# Altium project shieldMegaEstacionTT.PrjPcb
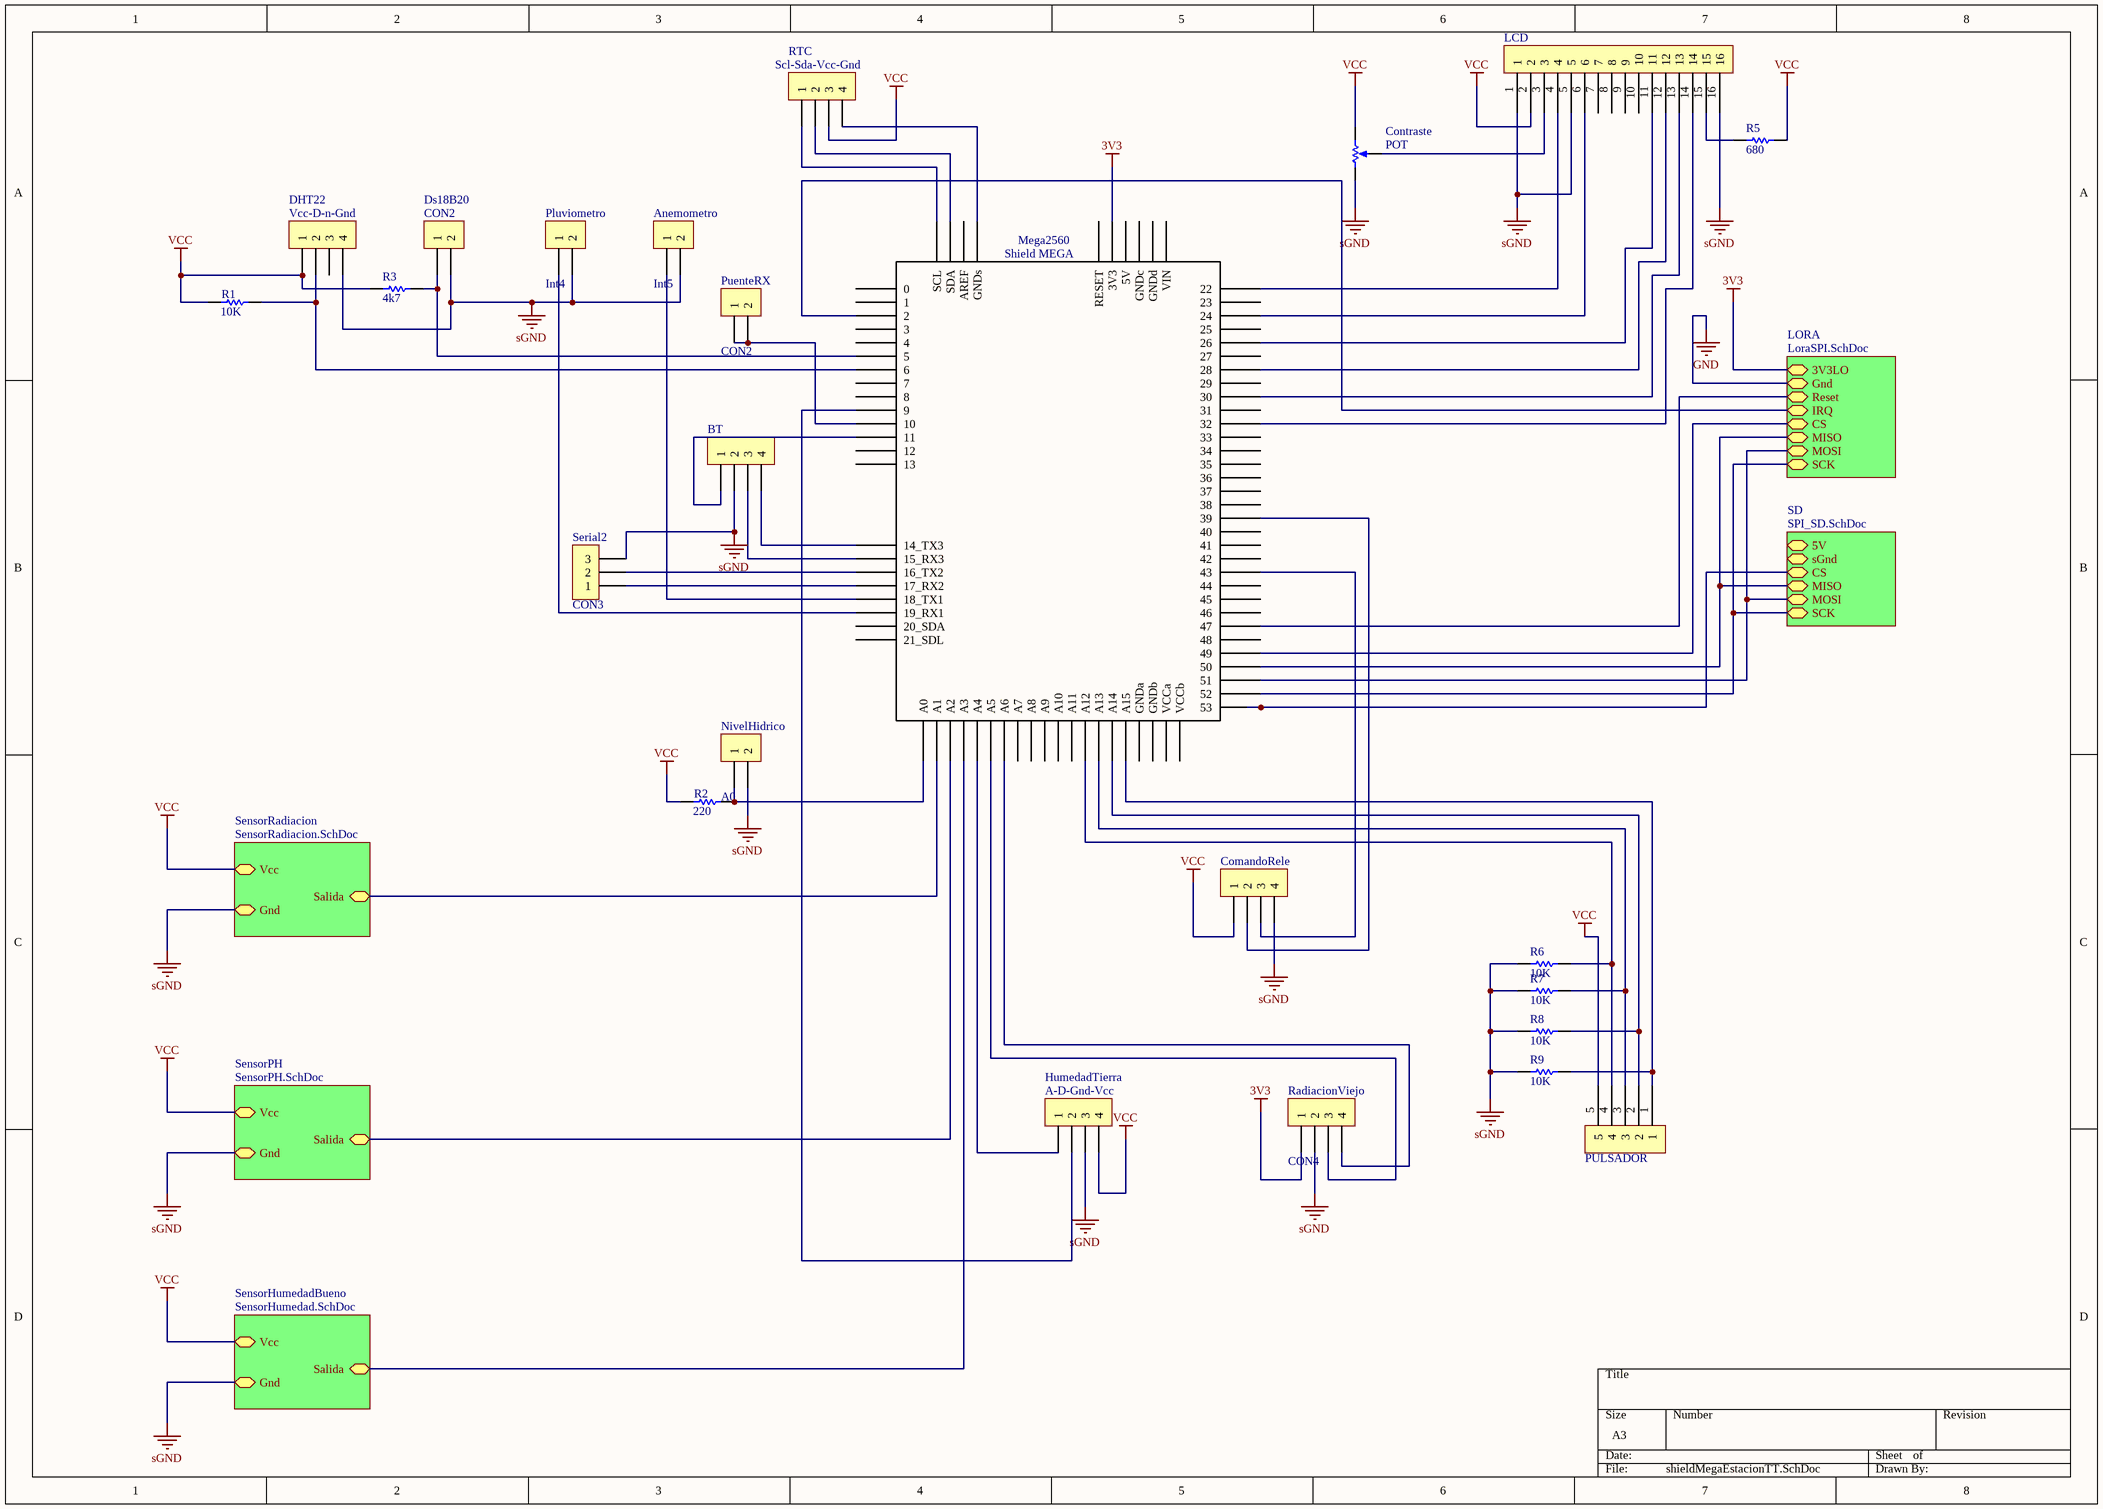
[diagram p0: shieldMegaEstacionTT.SchDoc]
6 sheets, 68 parts. Net scope: hierarchical (ports join the sheet entries above them; power ports are global).
Board file: shieldMegaEstacionTT.PcbDoc
Sheets:
  shieldMegaEstacionTT.SchDoc
    SensorRadiacion = SensorRadiacion.SchDoc
    SensorPH = SensorPH.SchDoc
    SensorHumedadBueno = SensorHumedad.SchDoc
    LORA = LoraSPI.SchDoc
    SD = SPI_SD.SchDoc

## Sheet shieldMegaEstacionTT.SchDoc
size A3

### Parts
Anemometro  Int5  [BORNERA2 - T]
BT  CON4  [CON4]  (value not drawn)
ComandoRele  CON4  [CON4]  (value not drawn)
Contraste  POT  [PRESET2]
DHT22  Vcc-D-n-Gnd  [BORNERA4]
Ds18B20  CON2  [BORNERA2 - T]
HumedadTierra  A-D-Gnd-Vcc  [CON4]
LCD  CON16  [CON2X8]  (value not drawn)
Mega2560  Shield MEGA  [Shield Mega]
NivelHidrico  A0  [BORNERA2 - T]
Pluviometro  Int4  [BORNERA2 - T]
PuenteRX  CON2  [CON2]
PULSADOR  CON5  [CON5]  (value not drawn)
R1  10K  [RES300]
R2  220  [RES300]
R3  4k7  [RES300]
R5  680  [RES300]
R6  10K  [RES300]
R7  10K  [RES300]
R8  10K  [RES300]
R9  10K  [RES300]
RadiacionViejo  CON4  [BORNERA4 - T]
RTC  Scl-Sda-Vcc-Gnd  [CON4]
Serial2  CON3  [CON3]

### Sub-sheets
LORA = LoraSPI.SchDoc: 3V3LO (bidir), Gnd, Reset, IRQ, CS, MISO, MOSI, SCK
SD = SPI_SD.SchDoc: 5V, sGnd, CS, MISO, MOSI, SCK
SensorHumedadBueno = SensorHumedad.SchDoc: Vcc, Gnd, Salida
SensorPH = SensorPH.SchDoc: Vcc, Gnd, Salida
SensorRadiacion = SensorRadiacion.SchDoc: Vcc, Gnd, Salida

### Nets
3V3: Mega2560.3V3 RadiacionViejo.1 ; sheet LORA/3V3LO
sGND: Anemometro.2 BT.2 ComandoRele.4 Contraste.2 DHT22.4 Ds18B20.2 HumedadTierra.3 LCD.1 LCD.5 LCD.16 NivelHidrico.2 Pluviometro.2 R6.1 R7.1 R8.1 R9.1 RadiacionViejo.2 Serial2.3 ; sheet SensorRadiacion/Gnd, sheet SensorPH/Gnd, sheet SensorHumedadBueno/Gnd
VCC: ComandoRele.1 Contraste.1 DHT22.1 HumedadTierra.4 LCD.2 PULSADOR.5 R1.1 R2.1 R3.1 R5.1 RTC.3 ; sheet SensorRadiacion/Vcc, sheet SensorPH/Vcc, sheet SensorHumedadBueno/Vcc
NetAnemometro_1: Anemometro.1 Mega2560.18(18_TX1)
NetBT_1: BT.1 Mega2560.11
NetBT_3: BT.3 Mega2560.15(15_RX3)
NetBT_4: BT.4 Mega2560.14(14_TX3)
NetComandoRele_2: ComandoRele.2 Mega2560.39
NetComandoRele_3: ComandoRele.3 Mega2560.43
NetContraste_3: Contraste.3 LCD.3
NetDHT22_2: DHT22.2 Mega2560.6 R1.2
NetDs18B20_1: Ds18B20.1 Mega2560.5 R3.2
NetHumedadTierra_1: HumedadTierra.1 Mega2560.A4
NetHumedadTierra_2: HumedadTierra.2 Mega2560.9
NetIC1Lora_8: Mega2560.50 ; sheet LORA/MISO, sheet SD/MISO
NetIC2SD_1: Mega2560.53 ; sheet SD/CS
NetIC2SD_2: Mega2560.52 ; sheet LORA/SCK, sheet SD/SCK
NetIC2SD_12: Mega2560.51 ; sheet LORA/MOSI, sheet SD/MOSI
NetLCD_4: LCD.4 Mega2560.22
NetLCD_6: LCD.6 Mega2560.24
NetLCD_11: LCD.11 Mega2560.26
NetLCD_12: LCD.12 Mega2560.28
NetLCD_13: LCD.13 Mega2560.30
NetLCD_14: LCD.14 Mega2560.32
NetLCD_15: LCD.15 R5.2
NetMega2560_2: Mega2560.2 ; sheet LORA/IRQ
NetMega2560_10: Mega2560.10 PuenteRX.1 PuenteRX.2
NetMega2560_16: Mega2560.16(16_TX2) Serial2.2
NetMega2560_17: Mega2560.17(17_RX2) Serial2.1
NetMega2560_19: Mega2560.19(19_RX1) Pluviometro.1
NetMega2560_47: Mega2560.47 ; sheet LORA/Reset
NetMega2560_49: Mega2560.49 ; sheet LORA/CS
NetMega2560_A0: Mega2560.A0 NivelHidrico.1 R2.2
NetMega2560_A1: Mega2560.A1 ; sheet SensorRadiacion/Salida
NetMega2560_A2: Mega2560.A2 ; sheet SensorPH/Salida
NetMega2560_A3: Mega2560.A3 ; sheet SensorHumedadBueno/Salida
NetMega2560_A5: Mega2560.A5 RadiacionViejo.3
NetMega2560_A6: Mega2560.A6 RadiacionViejo.4
NetMega2560_A12: Mega2560.A12 PULSADOR.4 R6.2
NetMega2560_A13: Mega2560.A13 PULSADOR.3 R7.2
NetMega2560_A14: Mega2560.A14 PULSADOR.2 R8.2
NetMega2560_A15: Mega2560.A15 PULSADOR.1 R9.2
NetMega2560_GNDs: Mega2560.GNDs RTC.4
NetMega2560_SCL: Mega2560.SCL RTC.1
NetMega2560_SDA: Mega2560.SDA RTC.2

Not connected (* = marked no-connect by the designer): DHT22 3; LCD 7 8 9 10; Mega2560 0 1 3 4 5V 7 8 12 13 20(20_SDA) 21(21_SDL) 23 25 27 29 31 33 34 35 36 37 38 40 41 42 44 45 46 48 A7 A8 A9 A10 A11 AREF GNDa GNDb GNDc GNDd RESET VCCa VCCb VIN

### Library data of the parts
Anemometro Ds18B20 NivelHidrico Pluviometro PuenteRX = CON2: Conector 2
BT ComandoRele DHT22 HumedadTierra RadiacionViejo RTC = CON4: Conector 4
Contraste = POT: Potenciometro - Preset
LCD = CON16: Conector 16
PULSADOR = CON5: Conector 5
R1-R3 R5-R9 = RES: Resistencia
Serial2 = CON3: Conector 3

## Sheet SensorRadiacion.SchDoc
size A4
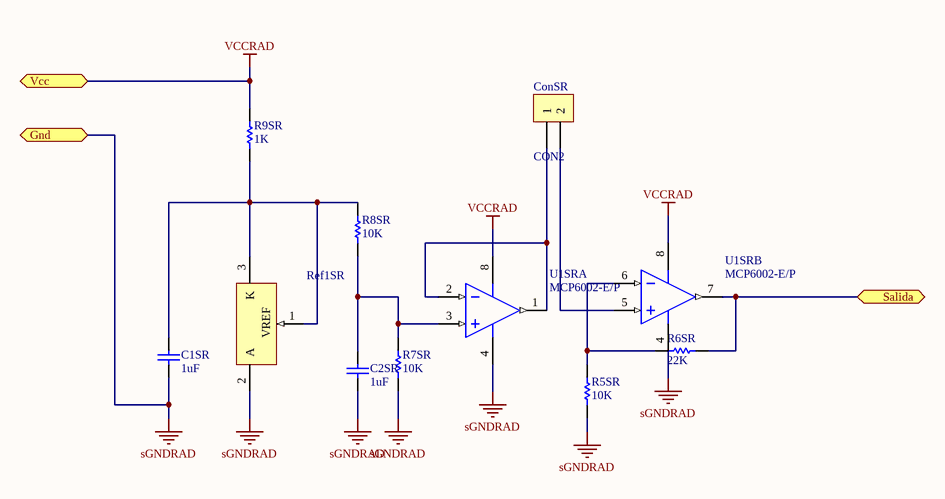
[diagram p1: SensorRadiacion.SchDoc]

### Parts
C1SR  1uF  [CAPPOL100]
C2SR  1uF  [CAPPOL100]
ConSR  CON2  [BORNERA2 - T]
R5SR  10K  [RES300]
R6SR  22K  [RES300]
R7SR  10K  [RES300]
R8SR  10K  [RES300]
R9SR  1K  [RES300]
Ref1SR  TL431ACLP  [LP03]  (value not drawn)
U1SR  MCP6002-E/P  [DIP8B]  (parts A,B of 2)

### Ports
Gnd, Salida, Vcc

### Nets
sGNDRAD: C1SR.1 C2SR.1 R5SR.1 R7SR.1 Ref1SR.2(A) U1SR.4(VSS) ; port Gnd  [project net sGND]
VCCRAD: R9SR.2 U1SR.8(VDD) ; port Vcc  [project net VCC]
NetC1SR_2: C1SR.2 R8SR.2 R9SR.1 Ref1SR.1(VREF) Ref1SR.3(K)
NetC2SR_2: C2SR.2 R7SR.2 R8SR.1 U1SR.3(VINA+)
NetConSR_1: ConSR.1 U1SR.1(VOUTA) U1SR.2(VINA-)
NetConSR_2: ConSR.2 U1SR.5(VINB+)
NetMega2560_A1: R6SR.1 U1SR.7(VOUTB) ; port Salida
NetR5SR_2: R5SR.2 R6SR.2 U1SR.6(VINB-)

### Library data of the parts
C1SR C2SR = CAP: Capacitor
ConSR = CON2: Conector 2
R5SR R6SR R7SR R8SR R9SR = RES: Resistencia
Ref1SR = TL431ACLP: Adjustable Precision Shunt Regulator; Published: 15-Apr-2002; LatestRevisionDate: 06-Jun-2005; LatestRevisionNote: Sch pins 1 & 3 swapped; DatasheetVersion: Oct-2000; PackageVersion: Nov-2001; PackageReference: LP03; Publisher: Altium Limited; PackageDescription: TO, Flat Index; 3 In-Line, Axial Leads; Body Dia. 4.8mm; Leads 0.56 x 0.41 mm (max); Code_JEDEC: TO-226-AA; ComponentLink1Description: Manufacturer Link; ComponentLink1URL: http://www.ti.com/; ComponentLink2Description: Datasheet; ComponentLink2URL: http://www-s.ti.com/sc/ds/tl431a.pdf
U1SR = MCP6002-E/P: 1 MHz, Low-Power Operational Amplifier, 8-Pin PDIP, Extended Temperature; Published: 29-Jan-2009; LatestRevisionDate: 02-Dec-2009; LatestRevisionNote: Updated to datasheet revision J, Nov-2009; DatasheetVersion: revJ, Nov-2009; PackageVersion: revBB, Aug-2009; PackageReference: PDIP300-P8; Publisher: Altium Limited; PackageDescription: 8-Lead Plastic Dual In-Line (P) - 300 mil Body [PDIP]; Supplier 1: Digi-Key; Supplier Part Number 1: MCP6002-E/P-ND; Supplier 2: Farnell; Supplier Part Number 2: 1332117; Code_JEDEC: MS-001; ComponentLink1Description: Datasheet; ComponentLink1URL: http://ww1.microchip.com/downloads/en/DeviceDoc/21733j.pdf; ComponentLink2Description: Packaging Specification; ComponentLink2URL: http://www.microchip.com/stellent/groups/techpub_sg/documents/packagingspec/en012702.pdf; ComponentLink3Description: Microchip.com Home; ComponentLink3URL: http://www.microchip.com/

## Sheet SensorPH.SchDoc
size A4
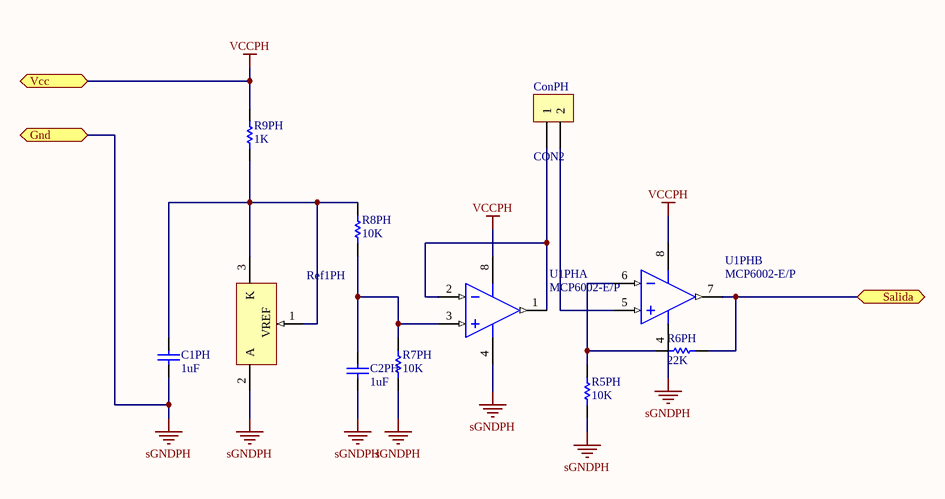
[diagram p2: SensorPH.SchDoc]

### Parts
C1PH  1uF  [CAPPOL100]
C2PH  1uF  [CAPPOL100]
ConPH  CON2  [BORNERA2 - T]
R5PH  10K  [RES300]
R6PH  22K  [RES300]
R7PH  10K  [RES300]
R8PH  10K  [RES300]
R9PH  1K  [RES300]
Ref1PH  TL431ACLP  [LP03]  (value not drawn)
U1PH  MCP6002-E/P  [DIP8B]  (parts A,B of 2)

### Ports
Gnd, Salida, Vcc

### Nets
sGNDPH: C1PH.1 C2PH.1 R5PH.1 R7PH.1 Ref1PH.2(A) U1PH.4(VSS) ; port Gnd  [project net sGND]
VCCPH: R9PH.2 U1PH.8(VDD) ; port Vcc  [project net VCC]
NetC1PH_2: C1PH.2 R8PH.2 R9PH.1 Ref1PH.1(VREF) Ref1PH.3(K)
NetC2PH_2: C2PH.2 R7PH.2 R8PH.1 U1PH.3(VINA+)
NetConPH_1: ConPH.1 U1PH.1(VOUTA) U1PH.2(VINA-)
NetConPH_2: ConPH.2 U1PH.5(VINB+)
NetMega2560_A2: R6PH.1 U1PH.7(VOUTB) ; port Salida
NetR5PH_2: R5PH.2 R6PH.2 U1PH.6(VINB-)

### Library data of the parts
C1PH C2PH = CAP: Capacitor
ConPH = CON2: Conector 2
R5PH R6PH R7PH R8PH R9PH = RES: Resistencia
Ref1PH = TL431ACLP: Adjustable Precision Shunt Regulator; Published: 15-Apr-2002; LatestRevisionDate: 06-Jun-2005; LatestRevisionNote: Sch pins 1 & 3 swapped; DatasheetVersion: Oct-2000; PackageVersion: Nov-2001; PackageReference: LP03; Publisher: Altium Limited; PackageDescription: TO, Flat Index; 3 In-Line, Axial Leads; Body Dia. 4.8mm; Leads 0.56 x 0.41 mm (max); Code_JEDEC: TO-226-AA; ComponentLink1Description: Manufacturer Link; ComponentLink1URL: http://www.ti.com/; ComponentLink2Description: Datasheet; ComponentLink2URL: http://www-s.ti.com/sc/ds/tl431a.pdf
U1PH = MCP6002-E/P: as U1SR on sheet SensorRadiacion; Published: 29-Jan-2009; LatestRevisionDate: 02-Dec-2009; LatestRevisionNote: Updated to datasheet revision J, Nov-2009; DatasheetVersion: revJ, Nov-2009; PackageVersion: revBB, Aug-2009; PackageReference: PDIP300-P8; Publisher: Altium Limited; PackageDescription: 8-Lead Plastic Dual In-Line (P) - 300 mil Body [PDIP]; Supplier 1: Digi-Key; Supplier Part Number 1: MCP6002-E/P-ND; Supplier 2: Farnell; Supplier Part Number 2: 1332117; Code_JEDEC: MS-001; ComponentLink1Description: Datasheet; ComponentLink1URL: http://ww1.microchip.com/downloads/en/DeviceDoc/21733j.pdf; ComponentLink2Description: Packaging Specification; ComponentLink2URL: http://www.microchip.com/stellent/groups/techpub_sg/documents/packagingspec/en012702.pdf; ComponentLink3Description: Microchip.com Home; ComponentLink3URL: http://www.microchip.com/

## Sheet SensorHumedad.SchDoc
size A4
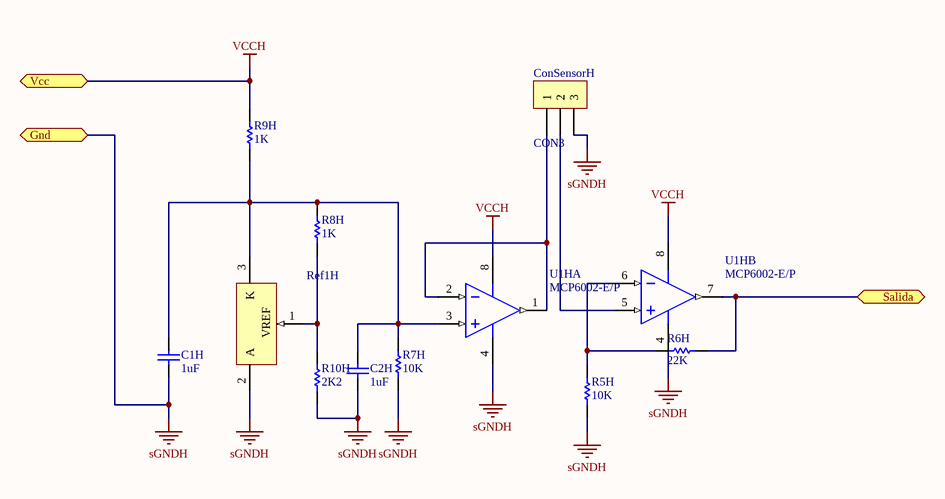
[diagram p3: SensorHumedad.SchDoc]

### Parts
C1H  1uF  [CAPPOL100]
C2H  1uF  [CAPPOL100]
ConSensorH  CON3  [BORNERA3 - T]
R5H  10K  [RES300]
R6H  22K  [RES300]
R7H  10K  [RES300]
R8H  1K  [RES300]
R9H  1K  [RES300]
R10H  2K2  [RES300]
Ref1H  TL431ACLP  [LP03]  (value not drawn)
U1H  MCP6002-E/P  [DIP8B]  (parts A,B of 2)

### Ports
Gnd, Salida, Vcc

### Nets
sGNDH: C1H.1 C2H.1 ConSensorH.3 R5H.1 R7H.1 R10H.1 Ref1H.2(A) U1H.4(VSS) ; port Gnd  [project net sGND]
VCCH: R9H.2 U1H.8(VDD) ; port Vcc  [project net VCC]
NetC1H_2: C1H.2 C2H.2 R7H.2 R8H.2 R9H.1 Ref1H.3(K) U1H.3(VINA+)
NetConSensorH_1: ConSensorH.1 U1H.1(VOUTA) U1H.2(VINA-)
NetConSensorH_2: ConSensorH.2 U1H.5(VINB+)
NetMega2560_A3: R6H.1 U1H.7(VOUTB) ; port Salida
NetR5H_2: R5H.2 R6H.2 U1H.6(VINB-)
NetR8H_1: R8H.1 R10H.2 Ref1H.1(VREF)

### Library data of the parts
C1H C2H = CAP: Capacitor
ConSensorH = CON3: Conector 3
R5H R6H R7H R8H R9H R10H = RES: Resistencia
Ref1H = TL431ACLP: Adjustable Precision Shunt Regulator; Published: 15-Apr-2002; LatestRevisionDate: 06-Jun-2005; LatestRevisionNote: Sch pins 1 & 3 swapped; DatasheetVersion: Oct-2000; PackageVersion: Nov-2001; PackageReference: LP03; Publisher: Altium Limited; PackageDescription: TO, Flat Index; 3 In-Line, Axial Leads; Body Dia. 4.8mm; Leads 0.56 x 0.41 mm (max); Code_JEDEC: TO-226-AA; ComponentLink1Description: Manufacturer Link; ComponentLink1URL: http://www.ti.com/; ComponentLink2Description: Datasheet; ComponentLink2URL: http://www-s.ti.com/sc/ds/tl431a.pdf
U1H = MCP6002-E/P: as U1SR on sheet SensorRadiacion; Published: 29-Jan-2009; LatestRevisionDate: 02-Dec-2009; LatestRevisionNote: Updated to datasheet revision J, Nov-2009; DatasheetVersion: revJ, Nov-2009; PackageVersion: revBB, Aug-2009; PackageReference: PDIP300-P8; Publisher: Altium Limited; PackageDescription: 8-Lead Plastic Dual In-Line (P) - 300 mil Body [PDIP]; Supplier 1: Digi-Key; Supplier Part Number 1: MCP6002-E/P-ND; Supplier 2: Farnell; Supplier Part Number 2: 1332117; Code_JEDEC: MS-001; ComponentLink1Description: Datasheet; ComponentLink1URL: http://ww1.microchip.com/downloads/en/DeviceDoc/21733j.pdf; ComponentLink2Description: Packaging Specification; ComponentLink2URL: http://www.microchip.com/stellent/groups/techpub_sg/documents/packagingspec/en012702.pdf; ComponentLink3Description: Microchip.com Home; ComponentLink3URL: http://www.microchip.com/

## Sheet LoraSPI.SchDoc
size A4
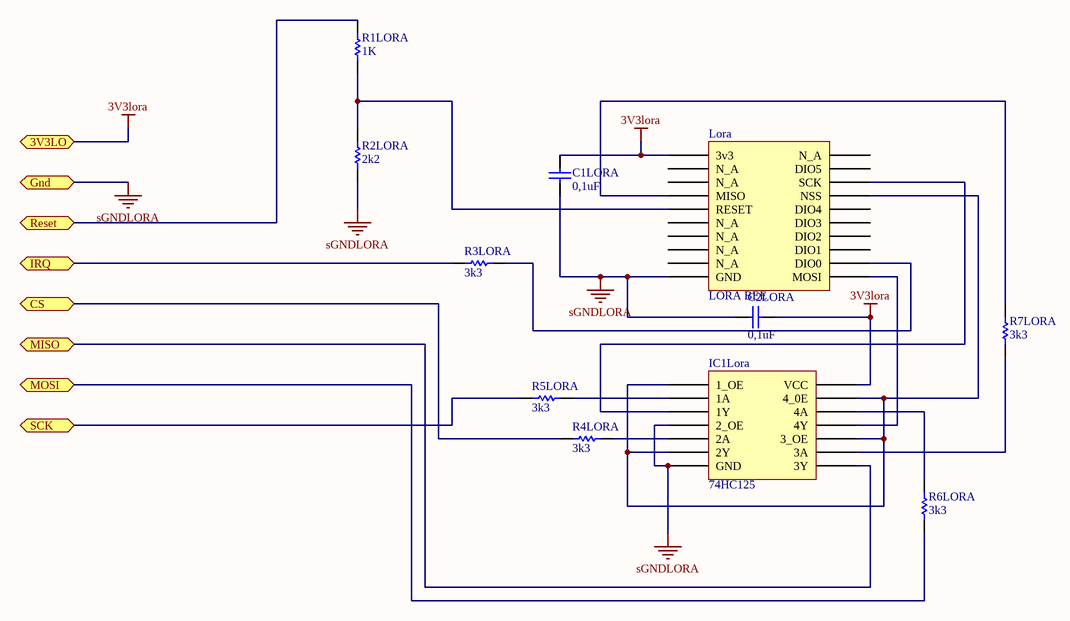
[diagram p4: LoraSPI.SchDoc]

### Parts
C1LORA  0,1uF  [CAP100]
C2LORA  0,1uF  [CAP100]
IC1Lora  74HC125  [DIP14B]
Lora  LORA BEE  [LORABEE]
R1LORA  1K  [RES300]
R2LORA  2k2  [RES300]
R3LORA  3k3  [RES300]
R4LORA  3k3  [RES300]
R5LORA  3k3  [RES300]
R6LORA  3k3  [RES300]
R7LORA  3k3  [RES300]

### Ports
3V3LO (bidir), CS, Gnd, IRQ, MISO, MOSI, Reset, SCK

### Nets
3V3lora: C1LORA.2 C2LORA.2 IC1Lora.14(VCC) Lora.1(3v3) ; port 3V3LO  [project net 3V3]
sGNDLORA: C1LORA.1 C2LORA.1 IC1Lora.4(2_OE) IC1Lora.7(GND) Lora.10(GND) R2LORA.1 ; port Gnd  [project net GND]
NetIC1Lora_1: IC1Lora.1(1_OE) IC1Lora.6(2Y) IC1Lora.10(3_OE) IC1Lora.13(4_0E) Lora.17(NSS)
NetIC1Lora_2: IC1Lora.2(1A) R5LORA.1
NetIC1Lora_3: IC1Lora.3(1Y) Lora.18(SCK)
NetIC1Lora_5: IC1Lora.5(2A) R4LORA.1
NetIC1Lora_8: IC1Lora.8(3Y) ; port MISO
NetIC1Lora_9: IC1Lora.9(3A) R7LORA.1
NetIC1Lora_11: IC1Lora.11(4Y) Lora.11(MOSI)
NetIC1Lora_12: IC1Lora.12(4A) R6LORA.2
NetIC2SD_2: R5LORA.2 ; port SCK
NetIC2SD_12: R6LORA.1 ; port MOSI
NetLora_4: Lora.4(MISO) R7LORA.2
NetLora_5: Lora.5(RESET) R1LORA.1 R2LORA.2
NetLora_12: Lora.12(DIO0) R3LORA.1
NetMega2560_2: R3LORA.2 ; port IRQ
NetMega2560_47: R1LORA.2 ; port Reset
NetMega2560_49: R4LORA.2 ; port CS

Not connected (* = marked no-connect by the designer): Lora 2(N_A) 3(N_A) 6(N_A) 7(N_A) 8(N_A) 9(N_A) 13(DIO1) 14(DIO2) 15(DIO3) 16(DIO4) 19(DIO5) 20(N_A)

### Library data of the parts
C1LORA C2LORA = CAP: Capacitor
R1LORA R2LORA R3LORA R4LORA R5LORA R6LORA R7LORA = RES: Resistencia

## Sheet SPI_SD.SchDoc
size A4
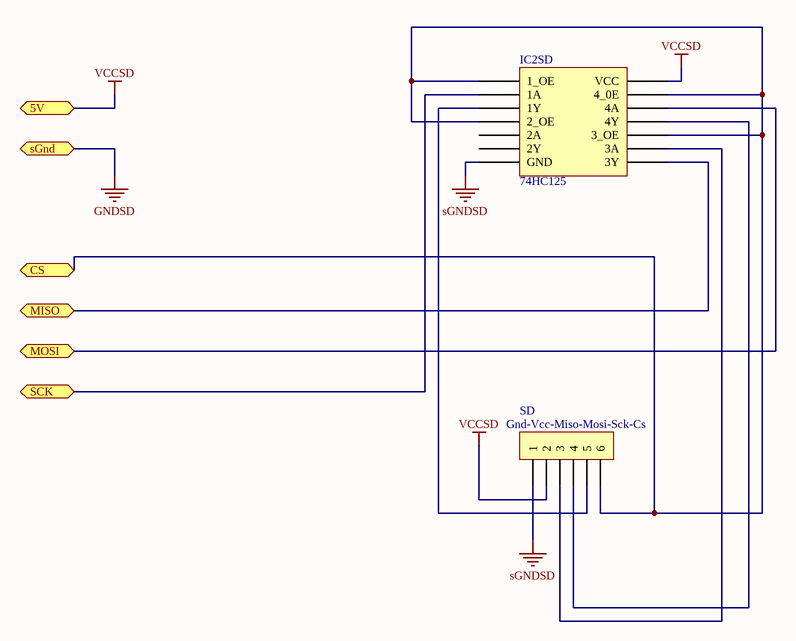
[diagram p5: SPI_SD.SchDoc]

### Parts
IC2SD  74HC125  [DIP14B]
SD  Gnd-Vcc-Miso-Mosi-Sck-Cs  [CON6]

### Ports
5V, CS, MISO, MOSI, SCK, sGnd

### Nets
GNDSD: port sGnd
sGNDSD: IC2SD.7(GND) SD.1
VCCSD: IC2SD.14(VCC) SD.2 ; port 5V
NetIC1Lora_8: IC2SD.8(3Y) ; port MISO
NetIC2SD_1: IC2SD.1(1_OE) IC2SD.4(2_OE) IC2SD.10(3_OE) IC2SD.13(4_0E) SD.6 ; port CS
NetIC2SD_2: IC2SD.2(1A) ; port SCK
NetIC2SD_3: IC2SD.3(1Y) SD.5
NetIC2SD_9: IC2SD.9(3A) SD.3
NetIC2SD_11: IC2SD.11(4Y) SD.4
NetIC2SD_12: IC2SD.12(4A) ; port MOSI

Not connected (* = marked no-connect by the designer): IC2SD 5(2A) 6(2Y)

### Library data of the parts
SD = CON6: Conector 6

## Nets that join several sheets
3V3: shieldMegaEstacionTT (Mega2560.3V3 RadiacionViejo.1), LoraSPI (C1LORA.2 C2LORA.2 IC1Lora.14 Lora.1)
sGND: shieldMegaEstacionTT (18 pins), SensorRadiacion (6 pins), SensorPH (6 pins), SensorHumedad (8 pins)
VCC: shieldMegaEstacionTT (11 pins), SensorRadiacion (R9SR.2 U1SR.8), SensorPH (R9PH.2 U1PH.8), SensorHumedad (R9H.2 U1H.8)
NetIC1Lora_8: shieldMegaEstacionTT (Mega2560.50), LoraSPI (IC1Lora.8), SPI_SD (IC2SD.8)
NetIC2SD_1: shieldMegaEstacionTT (Mega2560.53), SPI_SD (5 pins)
NetIC2SD_2: shieldMegaEstacionTT (Mega2560.52), LoraSPI (R5LORA.2), SPI_SD (IC2SD.2)
NetIC2SD_12: shieldMegaEstacionTT (Mega2560.51), LoraSPI (R6LORA.1), SPI_SD (IC2SD.12)
NetMega2560_2: shieldMegaEstacionTT (Mega2560.2), LoraSPI (R3LORA.2)
NetMega2560_47: shieldMegaEstacionTT (Mega2560.47), LoraSPI (R1LORA.2)
NetMega2560_49: shieldMegaEstacionTT (Mega2560.49), LoraSPI (R4LORA.2)
NetMega2560_A1: shieldMegaEstacionTT (Mega2560.A1), SensorRadiacion (R6SR.1 U1SR.7)
NetMega2560_A2: shieldMegaEstacionTT (Mega2560.A2), SensorPH (R6PH.1 U1PH.7)
NetMega2560_A3: shieldMegaEstacionTT (Mega2560.A3), SensorHumedad (R6H.1 U1H.7)